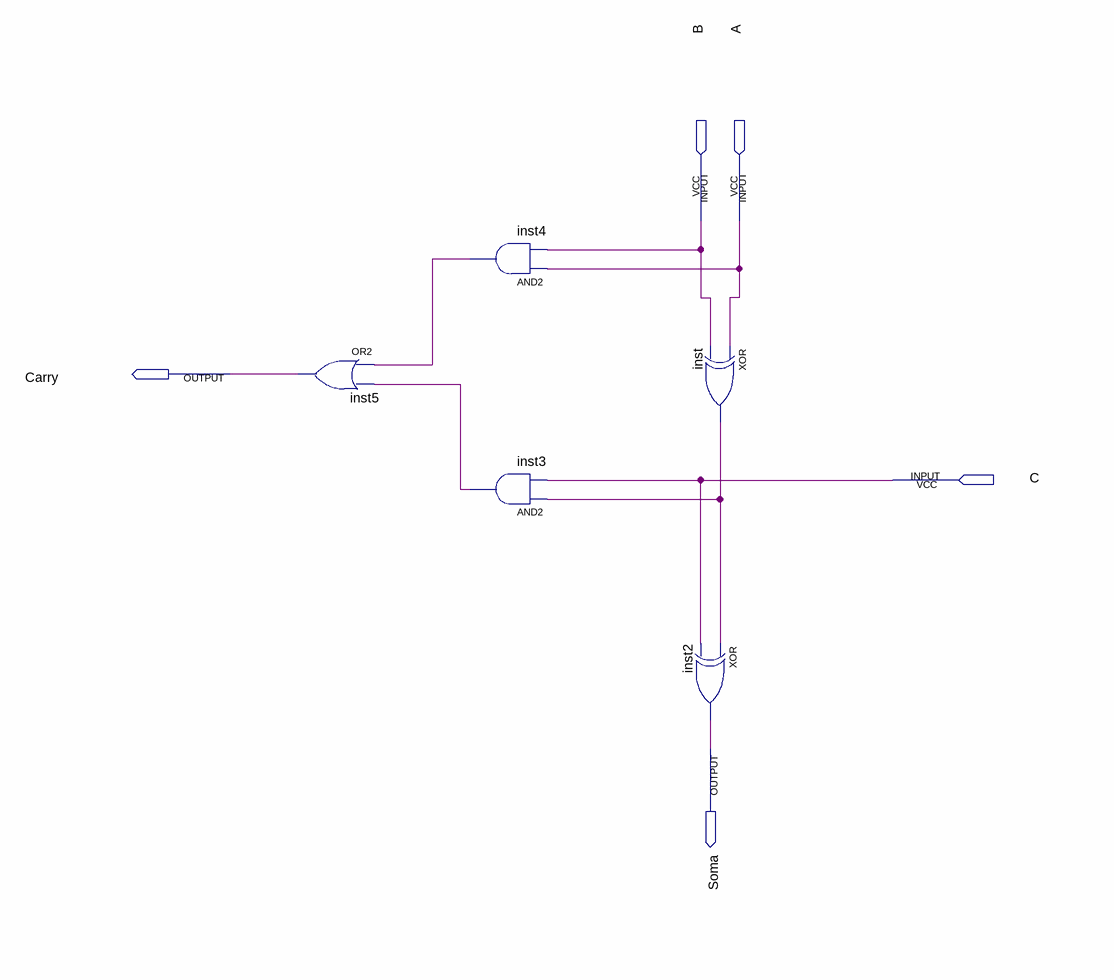
[diagram p0: schematic sheet]
// Quartus schematic Full-adder.bdf as structural Verilog: 5 symbols, 5 pins
module \Full-adder  (
  input  B,
  input  A,
  input  C,
  output Carry,
  output Soma
);

  wire inst3_out, inst4_out, inst_out;

  or inst5 (Carry, inst4_out, inst3_out);
  and inst4 (inst4_out, A, B);
  and inst3 (inst3_out, inst_out, C);
  xor inst2 (Soma, inst_out, C);
  xor inst (inst_out, A, B);
endmodule
